# EAGLE schematic CR123aBoost (EAGLE 5.10)
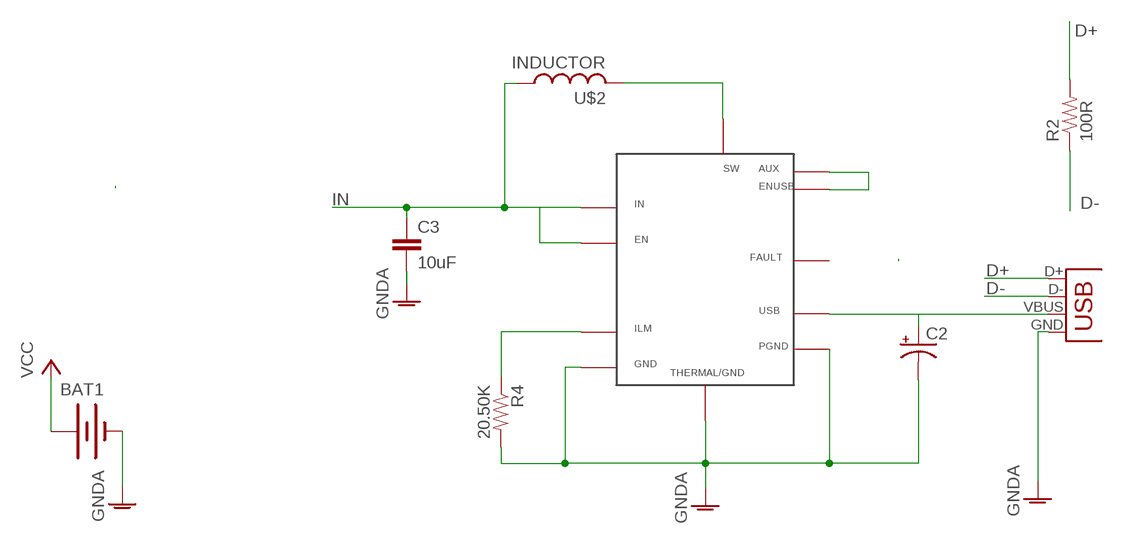
[diagram p0: schematic, sheet 1]

## Parts
BAT1  BATTERYCR123A  [BATTERY_CR123A]
C2  CAP_POL6032  [EIA6032]
C3  10uF  CAP1206  [1206]
R2  100R  RESISTOR  [0805]
R4  20.50K  RESISTOR0603-RES  [0603-RES]
U$1  TPS2500SON10  [SON-10]
U$2  INDUCTOR  [INDUCTOR-SD6603]
X1  USBKUSBX-SMT-AS1N  [KSUBX-SMT-AS1N]

## Nets
D+: R2.2 X1.D+
D-: R2.1 X1.D-
ENUSB: U$1.7(ENUSB) U$1.10(AUX)
GNDA: C2.P$2(-) C3.2 R4.2 U$1.2(PGND) U$1.5(GND) U$1.TH X1.GND
ILM: R4.1 U$1.6(ILM)
IN: C3.1 U$1.3(IN) U$1.4(EN) U$2.1
PGND: BAT1.- ; supply symbol labelled GNDA
SW: U$1.1(SW) U$2.2
USB: C2.P$1(+) U$1.9(USB) X1.VBUS
VCC: BAT1.+
Unconnected: U$1.8(FAULT)

## Library data of the parts
BAT1 = tvbgone-adj:BATTERY: Battery Holders Various common sizes : AA, AAA, 20mm coin cell and 12mm coin cell.
C2 = CR123aBoost:CAP_POL: Capacitor Polarized These are standard SMD and PTH capacitors. Normally 10uF, 47uF, and 100uF in electrolytic and tantalum varieties. Always verify the external diameter of the through hole cap, it varies with capacity, voltage, and manufacturer. The EIA devices should be standard.
C3 = CR123aBoost:CAP: Capacitor Standard 0603 ceramic capacitor, and 0.1" leaded capacitor.
R2 R4 = CR123aBoost:RESISTOR: Resistor Basic schematic elements and footprints for 0603, 1206, and PTH 1/10th watt (small) resistors.
U$1 = CR123aBoost:TPS2500
U$2 = CR123aBoost:INDUCTOR
X1 = CR123aBoost:USB: USB Connectors USB-B-PTH is fully proven SKU : PRT-00139 USB-miniB is fully proven SKU : PRT-00587 USB-A-PCB is untested. USB-A-H is throughly reviewed, but untested. Spark Fun Electronics SKU : PRT-00437 USB-B-SMT is throughly reviewed, but untested. Needs silkscreen touching up. USB-A-S has not been used/tested USB-MB-H has not been used/tested